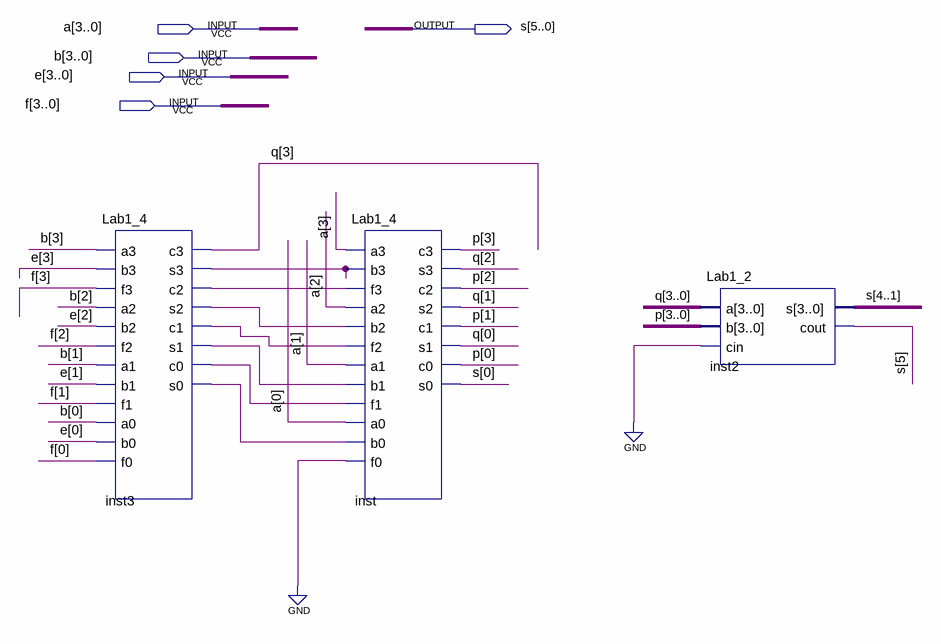
[diagram p0: schematic sheet]
// Quartus schematic Lab1_5.bdf as structural Verilog: 3 symbols, 5 pins
module Lab1_5 (
  input  [3:0] a,
  input  [3:0] b,
  input  [3:0] e,
  input  [3:0] f,
  output [5:0] s
);

  wire inst3_c0, inst3_c1, inst3_c2, inst3_s0, inst3_s1, inst3_s2, inst3_s3;
  wire [3:0] p, q;

  Lab1_4 inst3 (
    .a3(b[3]), .b3(e[3]), .f3(f[3]), .a2(b[2]), .b2(e[2]), .f2(f[2]), .a1(b[1]), .b1(e[1]), .f1(f[1]),
    .a0(b[0]), .b0(e[0]), .f0(f[0]), .c3(q[3]), .s3(inst3_s3), .c2(inst3_c2), .s2(inst3_s2), .c1(inst3_c1),
    .s1(inst3_s1), .c0(inst3_c0), .s0(inst3_s0));
  Lab1_4 inst (
    .a3(a[3]), .b3(inst3_s3), .f3(inst3_c2), .a2(a[2]), .b2(inst3_s2), .f2(inst3_c1), .a1(a[1]),
    .b1(inst3_s1), .f1(inst3_c0), .a0(a[0]), .b0(inst3_s0), .f0(1'b0), .c3(p[3]), .s3(q[2]), .c2(p[2]),
    .s2(q[1]), .c1(p[1]), .s1(q[0]), .c0(p[0]), .s0(s[0]));
  Lab1_2 inst2 (.a(q), .b(p), .cin(1'b0), .s(s[4:1]), .cout(s[5]));
endmodule
